# Altium schematic sheet Buffers.SchDoc: Buffers / Level Shifters
size A4; Date: 14.11.2023; ApprovedBy: M.Sc. Tobias Wirth; CheckedBy: M.Sc. Tobias Wirth; Author: M.Sc. Tobias Wirth; CompanyName: University of Stuttgart; DrawnBy: M.Sc. Tobias Wirth; Engineer: M.Sc. Tobias Wirth; Organization: IIS; Address1: Pfaffenwaldring 47; Address2: 70569 Stuttgart; Revision: V0.1; SheetNumber: 3; SheetTotal: 17; ProjectNameAlt: AUS - NMR System; Time: 21:30; ImagePath: N/A; Application_BuildNumber: N/A
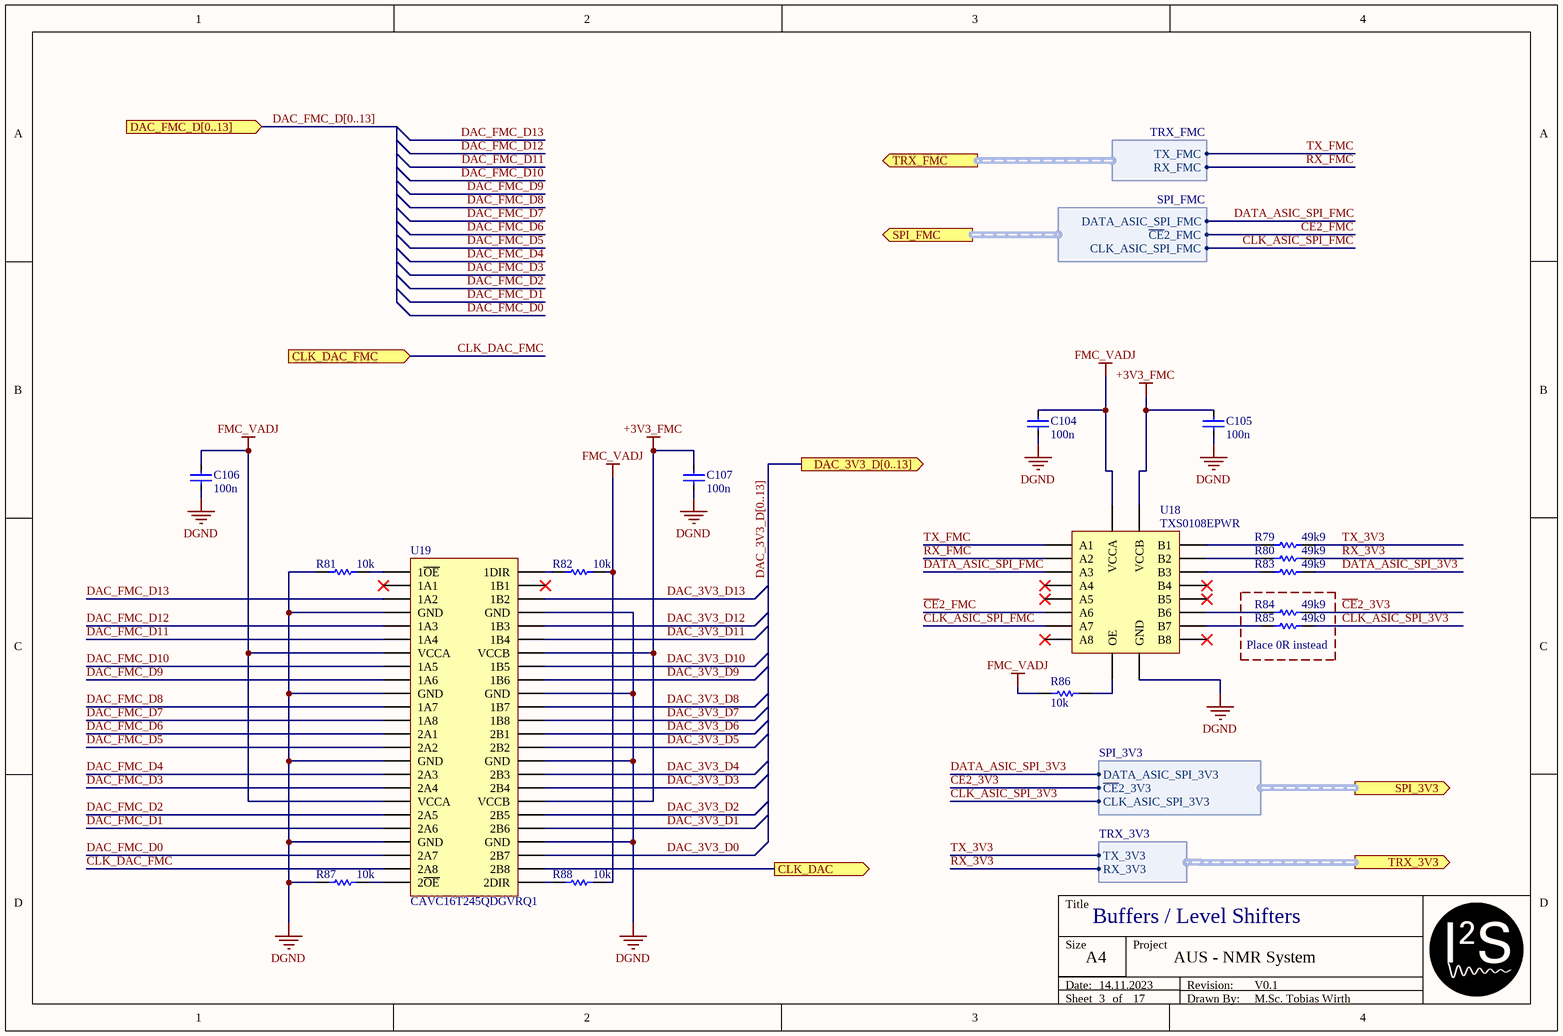
[diagram p0: Buffers.SchDoc]

## Parts
C104  100n  [CAP_0402]
C105  100n  [CAP_0402]
C106  100n  [CAP_0402]
C107  100n  [CAP_0402]
R79  49k9  [RES_0402]
R80  49k9  [RES_0402]
R81  10k  [RES_0402]
R82  10k  [RES_0402]
R83  49k9  [RES_0402]
R84  49k9  [RES_0402]
R85  49k9  [RES_0402]
R86  10k  [RES_0402]
R87  10k  [RES_0402]
R88  10k  [RES_0402]
U18  TXS0108EPWR  [TSSOP-20]
U19  CAVC16T245QDGVRQ1  [TSSOP40P640X120-48N]

## Blocks framed on the sheet
Place 0R instead: R84 R85

## Ports
CLK_DAC (out), CLK_DAC_FMC (in), DAC_3V3_D[0..13] (out), DAC_FMC_D[0..13] (in), SPI_3V3 (out, harness SPI_3V3), SPI_FMC (out, harness SPI_FMC), TRX_3V3 (out, harness TRX_3V3), TRX_FMC (out, harness TRX_FMC)

## Harnesses
SPI_FMC: DATA_ASIC_SPI_FMC, ~{CE}2_FMC, CLK_ASIC_SPI_FMC
TRX_FMC: TX_FMC, RX_FMC
SPI_3V3: DATA_ASIC_SPI_3V3, ~{CE}2_3V3, CLK_ASIC_SPI_3V3
TRX_3V3: TX_3V3, RX_3V3

## Nets
+3V3_FMC: C105.1 C107.1 U18.19(VCCB) U19.7(VCCB) U19.18(VCCB)
DGND: C104.2 C105.2 C106.2 C107.2 R81.2 R87.2 U18.11(GND) U19.4(GND) U19.10(GND) U19.15(GND) U19.21(GND) U19.28(GND) U19.34(GND) U19.39(GND) U19.45(GND)
FMC_VADJ: C104.1 C106.1 R82.1 R86.2 R88.1 U18.2(VCCA) U19.31(VCCA) U19.42(VCCA)
~{CE}2_3V3: R84.2 ; port SPI_3V3.~{CE}2_3V3
~{CE}2_FMC: U18.7(A6) ; port SPI_FMC.~{CE}2_FMC
CLK_ASIC_SPI_3V3: R85.2 ; port SPI_3V3.CLK_ASIC_SPI_3V3
CLK_ASIC_SPI_FMC: U18.8(A7) ; port SPI_FMC.CLK_ASIC_SPI_FMC
CLK_DAC: U19.23(2B8) ; port CLK_DAC
CLK_DAC_FMC: U19.26(2A8) ; port CLK_DAC_FMC
DAC_3V3_D0: U19.22(2B7)
DAC_3V3_D1: U19.20(2B6)
DAC_3V3_D2: U19.19(2B5)
DAC_3V3_D3: U19.17(2B4)
DAC_3V3_D4: U19.16(2B3)
DAC_3V3_D5: U19.14(2B2)
DAC_3V3_D6: U19.13(2B1)
DAC_3V3_D7: U19.12(1B8)
DAC_3V3_D8: U19.11(1B7)
DAC_3V3_D9: U19.9(1B6)
DAC_3V3_D10: U19.8(1B5)
DAC_3V3_D11: U19.6(1B4)
DAC_3V3_D12: U19.5(1B3)
DAC_3V3_D13: U19.3(1B2)
DAC_FMC_D0: U19.27(2A7)
DAC_FMC_D1: U19.29(2A6)
DAC_FMC_D2: U19.30(2A5)
DAC_FMC_D3: U19.32(2A4)
DAC_FMC_D4: U19.33(2A3)
DAC_FMC_D5: U19.35(2A2)
DAC_FMC_D6: U19.36(2A1)
DAC_FMC_D7: U19.37(1A8)
DAC_FMC_D8: U19.38(1A7)
DAC_FMC_D9: U19.40(1A6)
DAC_FMC_D10: U19.41(1A5)
DAC_FMC_D11: U19.43(1A4)
DAC_FMC_D12: U19.44(1A3)
DAC_FMC_D13: U19.46(1A2)
DATA_ASIC_SPI_3V3: R83.2 ; port SPI_3V3.DATA_ASIC_SPI_3V3
DATA_ASIC_SPI_FMC: U18.4(A3) ; port SPI_FMC.DATA_ASIC_SPI_FMC
RX_3V3: R80.2 ; port TRX_3V3.RX_3V3
RX_FMC: U18.3(A2) ; port TRX_FMC.RX_FMC
TX_3V3: R79.2 ; port TRX_3V3.TX_3V3
TX_FMC: U18.1(A1) ; port TRX_FMC.TX_FMC
NetR79_1: R79.1 U18.20(B1)
NetR80_1: R80.1 U18.18(B2)
NetR81_1: R81.1 U19.48(1~{OE})
NetR82_2: R82.2 U19.1(1DIR)
NetR83_1: R83.1 U18.17(B3)
NetR84_1: R84.1 U18.14(B6)
NetR85_1: R85.1 U18.13(B7)
NetR86_1: R86.1 U18.10(OE)
NetR87_1: R87.1 U19.25(2~{OE})
NetR88_2: R88.2 U19.24(2DIR)

Not connected (* = marked no-connect by the designer): U18 5(A4)* 6(A5)* 9(A8)* 12(B8)* 15(B5)* 16(B4)*; U19 2(1B1)* 47(1A1)*

## Buses and harness runs
bus DAC_3V3_D[0..13] = port DAC_3V3_D[0..13]
bus DAC_FMC_D[0..13] = port DAC_FMC_D[0..13]

## Notes on the sheet
- Title
- Size
- Date:
- Sheet
- A4
- of
- Project
- Drawn By:
- Revision:

## Library data of the parts
C104-C107 = Cap: Supplier: *; Part Number: *; Value: 100n
R79-R88 = Res: Part Number: *; Supplier: *
  R79 R80 R83-R85: Value: 49k9
  R81 R82 R86-R88: Value: 10k
U18 = TXS0108EPWR: 8-Bit Bi-directional, Level-Shifting, Voltage Translator for Open-Drain and Push-Pull Applications; Supplier 1: Mouser; Supplier Part Number 1: 595-TXS0108EPWR
U19 = CAVC16T245QDGVRQ1: 16-Bit Dual-Supply Bus Transceiver With Configurable Voltage Translation and 3-State Outputs; Supplier 1: Mouser; Supplier Part Number 1: 595-AVC16T245QDGVRQ1